# EAGLE schematic Tractive System Diagram - Accumulator - 2 segments (EAGLE 8.1.0)
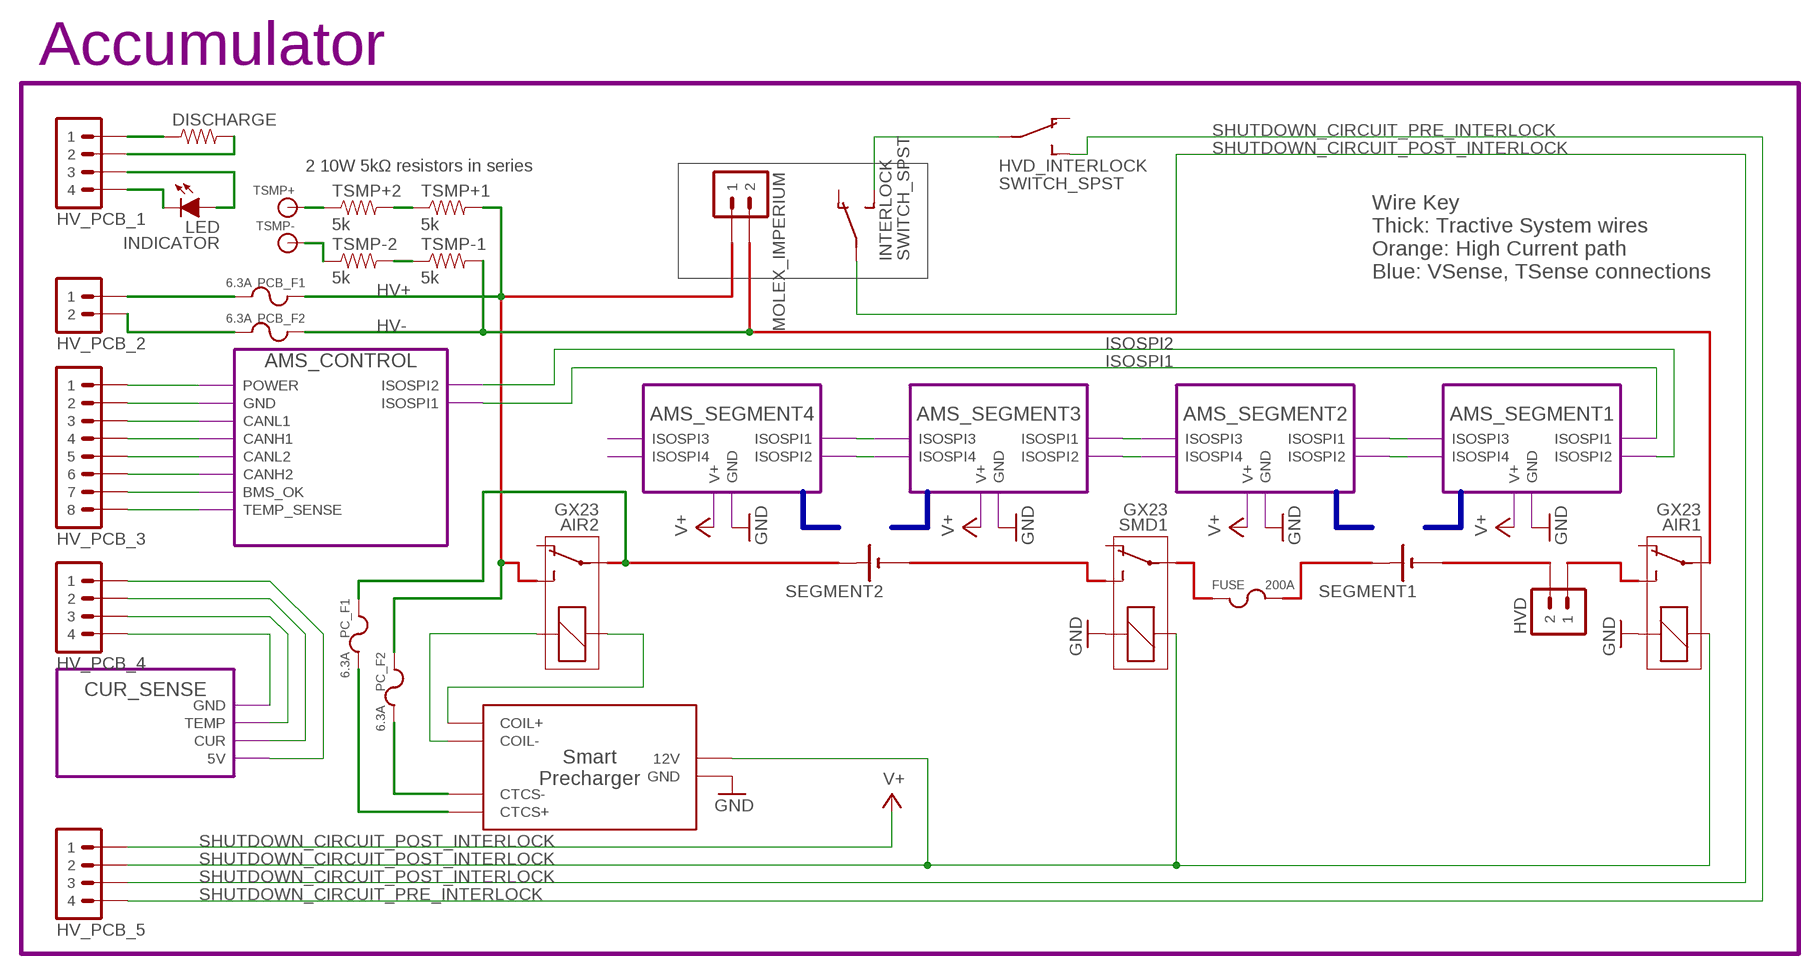
[diagram p0: schematic, sheet 1]

## Parts
AIR1  GX23  RELAY  (no package)
AIR2  GX23  RELAY  (no package)
DISCHARGE  RESISTOR10W  [10W_RESISTOR_VISHAY]
FUSE  200A  FUSE  (no package)
HV_PCB_1  M04  (no package)
HV_PCB_2  M02  (no package)
HV_PCB_3  M08  (no package)
HV_PCB_4  M04  (no package)
HV_PCB_5  M04  (no package)
HVD  M02  (no package)
HVD_INTERLOCK  SWITCH_SPST  (no package)
INDICATOR  LED  (no package)
INTERLOCK  SWITCH_SPST  (no package)
MOLEX_IMPERIUM  M02  (no package)
PC_F1  6.3A  FUSE  (no package)
PC_F2  6.3A  FUSE  (no package)
PCB_F1  6.3A  FUSE  (no package)
PCB_F2  6.3A  FUSE  (no package)
SEGMENT1  BATTERY_1_CELL  (no package)
SEGMENT2  BATTERY_1_CELL  (no package)
SMD1  GX23  RELAY  (no package)
TSMP+  BANANA_JACK  (no package)
TSMP+1  5k  RESISTOR10W  [10W_RESISTOR_VISHAY]
TSMP+2  5k  RESISTOR10W  [10W_RESISTOR_VISHAY]
TSMP-  BANANA_JACK  (no package)
TSMP-1  5k  RESISTOR10W  [10W_RESISTOR_VISHAY]
TSMP-2  5k  RESISTOR10W  [10W_RESISTOR_VISHAY]
U$1  SMART_PRECHARGER  (no package)

## Module instances
AMS_SEGMENT4 = AMS_SEGMENT
AMS_SEGMENT3 = AMS_SEGMENT
AMS_SEGMENT2 = AMS_SEGMENT
AMS_SEGMENT1 = AMS_SEGMENT
AMS_CONTROL = AMS_CONTROL
CUR_SENSE = BSPD_SENSE

## Nets
GND: AIR1.1 SMD1.1 U$1.GND ; port AMS_SEGMENT4.GND AMS_SEGMENT3.GND AMS_SEGMENT2.GND AMS_SEGMENT1.GND
HV+: PCB_F1.1 TSMP+1.2
HV-: PCB_F2.1 TSMP-1.2
ISOSPI1: port AMS_CONTROL.ISOSPI1 AMS_SEGMENT1.ISOSPI1
ISOSPI2: port AMS_CONTROL.ISOSPI2 AMS_SEGMENT1.ISOSPI2
N$1: TSMP+1.1 TSMP+2.2
N$2: TSMP-1.1 TSMP-2.2
N$3: HV_PCB_3.1 ; port AMS_CONTROL.POWER
N$4: port AMS_SEGMENT3.ISOSPI3 AMS_SEGMENT4.ISOSPI1
N$5: port AMS_SEGMENT3.ISOSPI4 AMS_SEGMENT4.ISOSPI2
N$6: port AMS_SEGMENT2.ISOSPI3 AMS_SEGMENT3.ISOSPI1
N$7: port AMS_SEGMENT2.ISOSPI4 AMS_SEGMENT3.ISOSPI2
N$8: port AMS_SEGMENT1.ISOSPI3 AMS_SEGMENT2.ISOSPI1
N$9: port AMS_SEGMENT1.ISOSPI4 AMS_SEGMENT2.ISOSPI2
N$10: DISCHARGE.1 HV_PCB_1.1
N$11: PC_F2.1
N$12: DISCHARGE.2 HV_PCB_1.2
N$13: PC_F1.1
N$14: TSMP+2.1 TSMP+.1
N$15: HV_PCB_3.2 ; port AMS_CONTROL.GND
N$16: TSMP-2.1 TSMP-.1
N$17: HV_PCB_1.3 INDICATOR.A
N$18: HV_PCB_1.4 INDICATOR.C
N$19: HV_PCB_3.3 ; port AMS_CONTROL.CANL1
N$20: AIR2.2 U$1.COIL+
N$21: AIR2.1 U$1.COIL-
N$22: HV_PCB_2.1 PCB_F1.2
N$24: HV_PCB_2.2 PCB_F2.2
N$31: HV_PCB_3.4 ; port AMS_CONTROL.CANH1
N$35: PC_F1.2 U$1.CTCS+
N$36: PC_F2.2 U$1.CTCS-
N$40: HV_PCB_3.5 ; port AMS_CONTROL.CANL2
N$41: HV_PCB_3.6 ; port AMS_CONTROL.CANH2
N$42: HV_PCB_3.8 ; port AMS_CONTROL.TEMP_SENSE
N$47: HV_PCB_4.4 ; port CUR_SENSE.GND
N$48: HV_PCB_4.3 ; port CUR_SENSE.TEMP
N$49: HV_PCB_4.2 ; port CUR_SENSE.CUR
N$50: HV_PCB_4.1 ; port CUR_SENSE.5V
N$53: HVD_INTERLOCK.P INTERLOCK.S
N$54: HV_PCB_3.7 ; port AMS_CONTROL.BMS_OK
SHUTDOWN_CIRCUIT_POST_INTERLOCK: AIR1.2 HV_PCB_5.1 HV_PCB_5.2 HV_PCB_5.3 INTERLOCK.P SMD1.2 U$1.12V ; supply symbol labelled V+
SHUTDOWN_CIRCUIT_PRE_INTERLOCK: HV_PCB_5.4 HVD_INTERLOCK.S
V+: port AMS_SEGMENT4.V+ AMS_SEGMENT3.V+ AMS_SEGMENT2.V+ AMS_SEGMENT1.V+
Unconnected: AIR1.O AIR1.P AIR1.S AIR2.O AIR2.P AIR2.S FUSE.1 FUSE.2 HVD.1 HVD.2 HVD_INTERLOCK.O INTERLOCK.O MOLEX_IMPERIUM.1 MOLEX_IMPERIUM.2 SEGMENT1.+ SEGMENT1.- SEGMENT2.+ SEGMENT2.- SMD1.O SMD1.P SMD1.S

## Buses
B$1
B$2
B$3
B$4

## Notes on the sheet
- Accumulator
- 2 10W 5kΩ resistors in series
- Wire Key
  Thick: Tractive System wires
  Orange: High Current path
  Blue: VSense, TSense connections

## Library data of the parts
AIR1 AIR2 SMD1 = HyTechSymbols:RELAY: RELAY 1 x switch
DISCHARGE TSMP+1 TSMP+2 TSMP-1 TSMP-2 = HyTechDevices:RESISTOR: Resistor Basic schematic elements and footprints for 0603, 1206, and PTH resistors.
FUSE PC_F1 PC_F2 PCB_F1 PCB_F2 = HyTechSymbols:FUSE: Generic Fuse
HV_PCB_1 HV_PCB_4 HV_PCB_5 = HyTechSymbols:M04: Generic 4-pin connector
HV_PCB_2 HVD MOLEX_IMPERIUM = HyTechSymbols:M02: Generic 2-pin connector
HV_PCB_3 = HyTechSymbols:M08: Generic 8-pin connector
HVD_INTERLOCK INTERLOCK = HyTechSymbols:SWITCH_SPST: Single Pull Single Throw Switch
INDICATOR = HyTechSymbols:LED: Generic LED
SEGMENT1 SEGMENT2 = HyTechSymbols:BATTERY_1_CELL: Generic 1-cell battery Source: Sonnenschein
TSMP+ TSMP- = HyTechSymbols:BANANA_JACK: Banana Jack Purchasing: Mouser - Red <http://www.mouser.com/ProductDetail/Pomona-Electronics/72930-2/?qs=2nDnb8a6ouM2t6dPw1JBow%3D%3D> Mouser - Black <http://www.mouser.com/ProductDetail/Pomona-Electronics/72930-0/?qs=2nDnb8a6ouNpA2wl9kKnzA%3D%3D>
U$1 = HyTechSymbols:SMART_PRECHARGER: Smart Precharger http://www.zeva.com.au/Products/datasheets/SmartPrechargerV1-3.pdf

## Module HV_ECU
Ports: TSVP_POWER(out) TSAL/TSEL_POWER(out) BSPD_CUR_FAULT(out) HV+(pas) HV-(pas) AI-(in) AI+(out) BMS_POWER(out) IMD_GND(out) OKHS_OUT(out) IMD_OKHS(in) BMS_GND(in) IMD_HV+(nc) IMD_HV-(nc) SHUTDOWN6_OUT(out) SHUTDOWN6_IN(in) SHUTDOWN7_EXT_OUT(out) BMS_OK_OUT(out) CANL_OUT(io) CANH_OUT(io) AIR_PWR1(out) AIR_PWR2(out) SHUTDOWN7_IN(in) DISCHARGE-(in) DISCHARGE+(out) BMS_CANL1(io) BMS_CANH1(io) BMS_CANL2(io) BMS_CANH2(io) TEMP_SENSE_OUT(out) IMD_SUPPLY(out) 12VSUPPLY(in) GND(out) CANL_IN(io) CANH_IN(io) CUR_SENSE(in) CUR_GND(in) CUR_5V(out) TEMP_SENSE(in) BMS_OK(in)

### Library data of the parts

## Module AMS_SEGMENT
Ports: ISOSPI1(io) ISOSPI2(io) ISOSPI3(io) ISOSPI4(io) V+(in) GND(out)

### Library data of the parts

## Module AMS_CONTROL
Ports: ISOSPI2(io) ISOSPI1(io) GND(out) POWER(in) CANL1(io) CANL2(io) CANH1(io) CANH2(io) TEMP_SENSE(in) BMS_OK(out)

### Library data of the parts

## Module BSPD_SENSE
Ports: GND(out) TEMP(out) CUR(out) 5V(in)

### Library data of the parts

## Module FSAE_ENERGY_METER
Ports: HV-OUT(nc) HV+OUT(nc) HV-IN(nc) HV+IN(nc) 12V+(in) GND(out)

### Library data of the parts